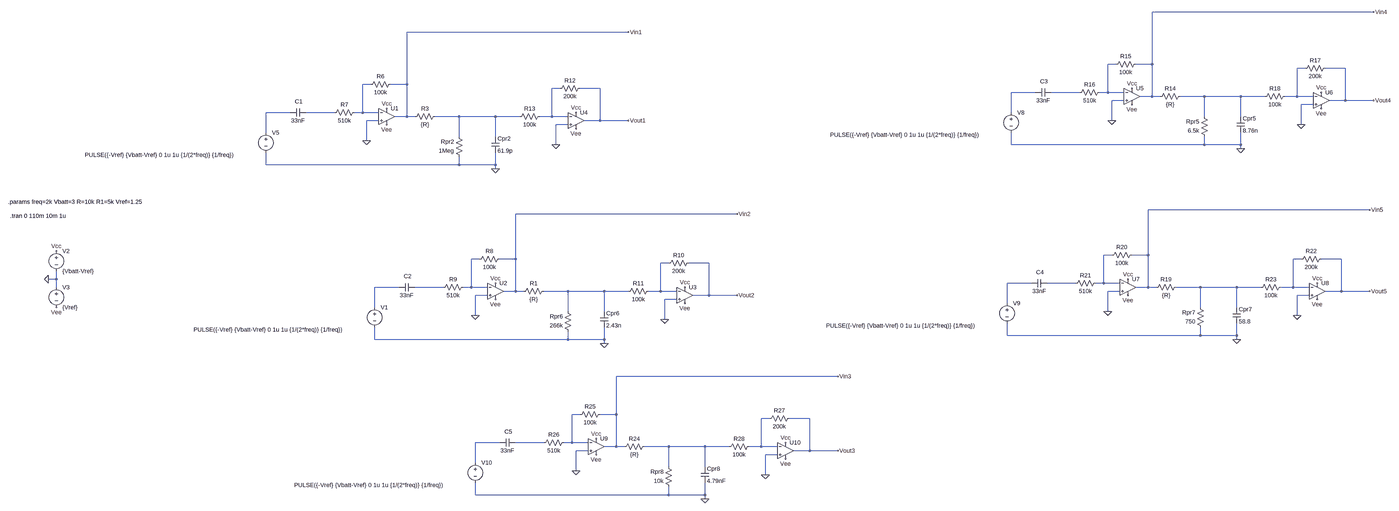
[diagram p0: schematic Data.asc, whole sheet]
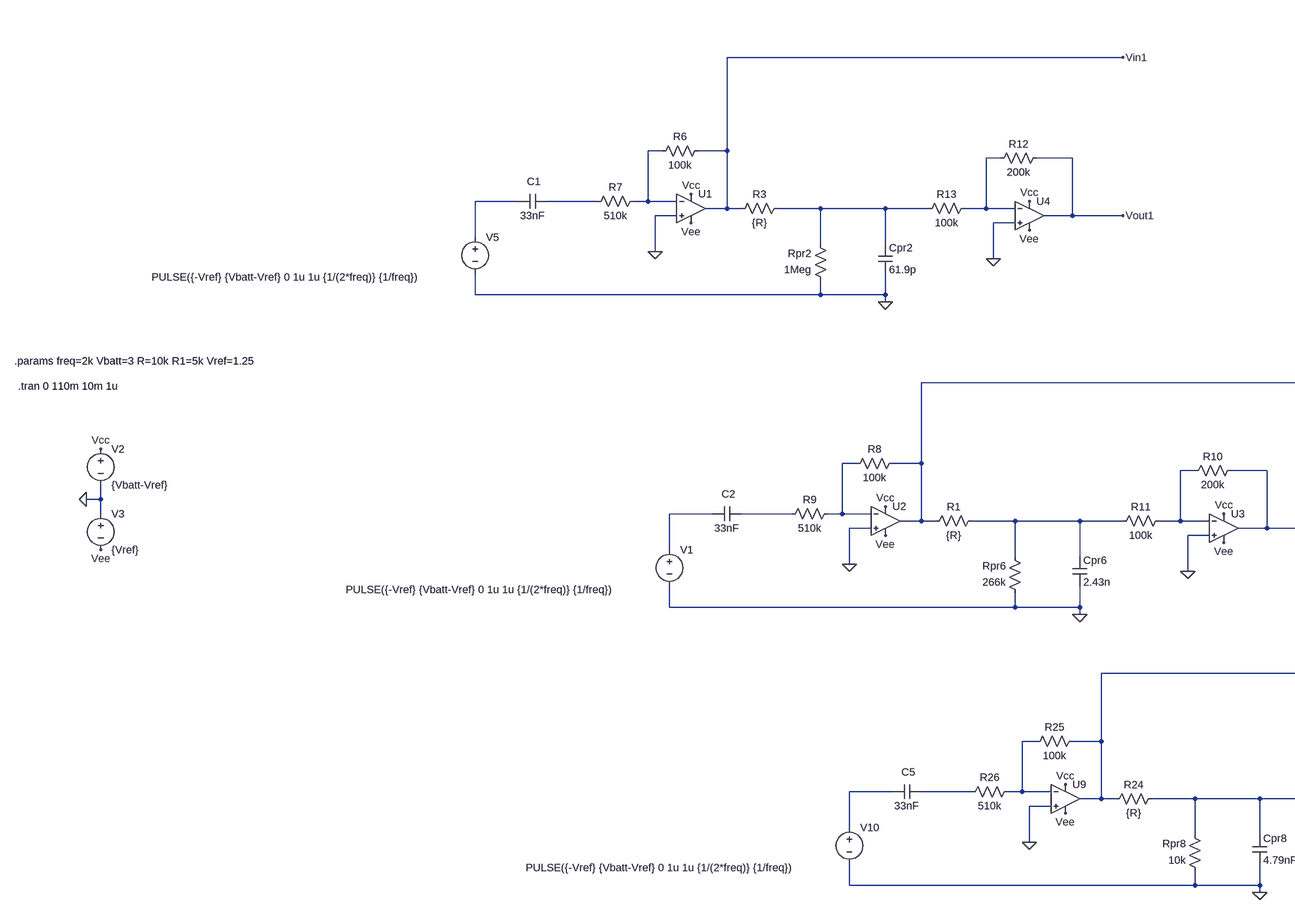
[diagram p1: schematic Data.asc, part, row 1 of 1, column 1 of 2]
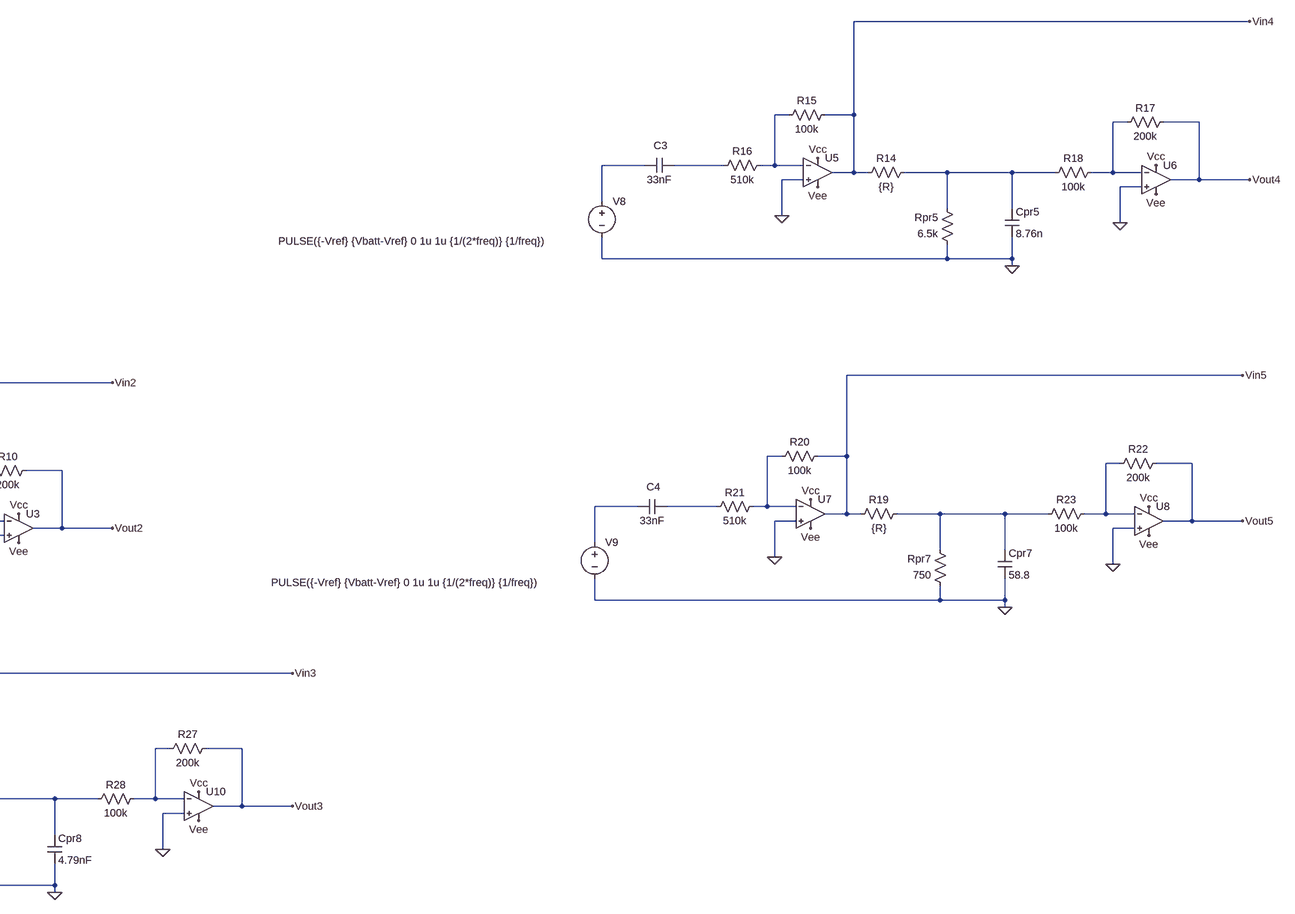
[diagram p2: schematic Data.asc, part, row 1 of 1, column 2 of 2]
Data.asc, the LTspice schematic file:
Version 4
SHEET 1 6228 2164
WIRE 6144 -448 5264 -448
WIRE 3184 -368 2304 -368
WIRE 5120 -240 5088 -240
WIRE 5264 -240 5264 -448
WIRE 5264 -240 5200 -240
WIRE 5872 -224 5840 -224
WIRE 6032 -224 5952 -224
WIRE 2160 -160 2128 -160
WIRE 2304 -160 2304 -368
WIRE 2304 -160 2240 -160
WIRE 2912 -144 2880 -144
WIRE 3072 -144 2992 -144
WIRE 4800 -128 4704 -128
WIRE 4976 -128 4864 -128
WIRE 5088 -128 5088 -240
WIRE 5088 -128 5056 -128
WIRE 5152 -128 5088 -128
WIRE 5264 -112 5264 -240
WIRE 5264 -112 5216 -112
WIRE 5296 -112 5264 -112
WIRE 5472 -112 5376 -112
WIRE 5616 -112 5472 -112
WIRE 5712 -112 5616 -112
WIRE 5840 -112 5840 -224
WIRE 5840 -112 5792 -112
WIRE 5904 -112 5840 -112
WIRE 5152 -96 5104 -96
WIRE 6032 -96 6032 -224
WIRE 6032 -96 5968 -96
WIRE 6144 -96 6032 -96
WIRE 5904 -80 5856 -80
WIRE 1840 -48 1744 -48
WIRE 2016 -48 1904 -48
WIRE 2128 -48 2128 -160
WIRE 2128 -48 2096 -48
WIRE 2192 -48 2128 -48
WIRE 4704 -48 4704 -128
WIRE 2304 -32 2304 -160
WIRE 2304 -32 2256 -32
WIRE 2336 -32 2304 -32
WIRE 2512 -32 2416 -32
WIRE 2656 -32 2512 -32
WIRE 2752 -32 2656 -32
WIRE 2880 -32 2880 -144
WIRE 2880 -32 2832 -32
WIRE 2944 -32 2880 -32
WIRE 5472 -32 5472 -112
WIRE 5616 -32 5616 -112
WIRE 2192 -16 2144 -16
WIRE 3072 -16 3072 -144
WIRE 3072 -16 3008 -16
WIRE 3184 -16 3072 -16
WIRE 5104 -16 5104 -96
WIRE 2944 0 2896 0
WIRE 5856 0 5856 -80
WIRE 1744 32 1744 -48
WIRE 2512 48 2512 -32
WIRE 2656 48 2656 -32
WIRE 2144 64 2144 -16
WIRE 2896 80 2896 0
WIRE 4704 80 4704 32
WIRE 5472 80 5472 48
WIRE 5472 80 4704 80
WIRE 5616 80 5616 32
WIRE 5616 80 5472 80
WIRE 5616 96 5616 80
WIRE 1744 160 1744 112
WIRE 2512 160 2512 128
WIRE 2512 160 1744 160
WIRE 2656 160 2656 112
WIRE 2656 160 2512 160
WIRE 2656 176 2656 160
WIRE 6128 656 5248 656
WIRE 3616 672 2736 672
WIRE 5104 864 5072 864
WIRE 5248 864 5248 656
WIRE 5248 864 5184 864
WIRE 2592 880 2560 880
WIRE 2736 880 2736 672
WIRE 2736 880 2672 880
WIRE 5856 880 5824 880
WIRE 6016 880 5936 880
WIRE 3344 896 3312 896
WIRE 3504 896 3424 896
WIRE 912 960 912 928
WIRE 912 960 880 960
WIRE 4784 976 4688 976
WIRE 4960 976 4848 976
WIRE 5072 976 5072 864
WIRE 5072 976 5040 976
WIRE 5136 976 5072 976
WIRE 912 992 912 960
WIRE 2272 992 2176 992
WIRE 2448 992 2336 992
WIRE 2560 992 2560 880
WIRE 2560 992 2528 992
WIRE 2624 992 2560 992
WIRE 5248 992 5248 864
WIRE 5248 992 5200 992
WIRE 5280 992 5248 992
WIRE 5456 992 5360 992
WIRE 5600 992 5456 992
WIRE 5696 992 5600 992
WIRE 5824 992 5824 880
WIRE 5824 992 5776 992
WIRE 5888 992 5824 992
WIRE 2736 1008 2736 880
WIRE 2736 1008 2688 1008
WIRE 2768 1008 2736 1008
WIRE 2944 1008 2848 1008
WIRE 3088 1008 2944 1008
WIRE 3184 1008 3088 1008
WIRE 3312 1008 3312 896
WIRE 3312 1008 3264 1008
WIRE 3376 1008 3312 1008
WIRE 5136 1008 5088 1008
WIRE 6016 1008 6016 880
WIRE 6016 1008 5952 1008
WIRE 6128 1008 6016 1008
WIRE 2624 1024 2576 1024
WIRE 3504 1024 3504 896
WIRE 3504 1024 3440 1024
WIRE 3616 1024 3504 1024
WIRE 5888 1024 5840 1024
WIRE 3376 1040 3328 1040
WIRE 4688 1056 4688 976
WIRE 2176 1072 2176 992
WIRE 5456 1072 5456 992
WIRE 5600 1072 5600 992
WIRE 2944 1088 2944 1008
WIRE 3088 1088 3088 1008
WIRE 5088 1088 5088 1008
WIRE 2576 1104 2576 1024
WIRE 5840 1104 5840 1024
WIRE 3328 1120 3328 1040
WIRE 4688 1184 4688 1136
WIRE 5456 1184 5456 1152
WIRE 5456 1184 4688 1184
WIRE 5600 1184 5600 1136
WIRE 5600 1184 5456 1184
WIRE 2176 1200 2176 1152
WIRE 2944 1200 2944 1168
WIRE 2944 1200 2176 1200
WIRE 3088 1200 3088 1152
WIRE 3088 1200 2944 1200
WIRE 5600 1200 5600 1184
WIRE 3088 1216 3088 1200
WIRE 4016 1600 3136 1600
WIRE 2992 1808 2960 1808
WIRE 3136 1808 3136 1600
WIRE 3136 1808 3072 1808
WIRE 3744 1824 3712 1824
WIRE 3904 1824 3824 1824
WIRE 2672 1920 2576 1920
WIRE 2848 1920 2736 1920
WIRE 2960 1920 2960 1808
WIRE 2960 1920 2928 1920
WIRE 3024 1920 2960 1920
WIRE 3136 1936 3136 1808
WIRE 3136 1936 3088 1936
WIRE 3168 1936 3136 1936
WIRE 3344 1936 3248 1936
WIRE 3488 1936 3344 1936
WIRE 3584 1936 3488 1936
WIRE 3712 1936 3712 1824
WIRE 3712 1936 3664 1936
WIRE 3776 1936 3712 1936
WIRE 3024 1952 2976 1952
WIRE 3904 1952 3904 1824
WIRE 3904 1952 3840 1952
WIRE 4016 1952 3904 1952
WIRE 3776 1968 3728 1968
WIRE 2576 2000 2576 1920
WIRE 3344 2016 3344 1936
WIRE 3488 2016 3488 1936
WIRE 2976 2032 2976 1952
WIRE 3728 2048 3728 1968
WIRE 2576 2128 2576 2080
WIRE 3344 2128 3344 2096
WIRE 3344 2128 2576 2128
WIRE 3488 2128 3488 2080
WIRE 3488 2128 3344 2128
WIRE 3488 2144 3488 2128
FLAG 880 960 0
FLAG 912 848 Vcc
FLAG 912 1072 Vee
FLAG 2656 176 0
FLAG 2224 0 Vee
FLAG 2224 -64 Vcc
FLAG 2144 64 0
FLAG 2976 16 Vee
FLAG 2976 -48 Vcc
FLAG 2896 80 0
FLAG 5616 96 0
FLAG 5184 -80 Vee
FLAG 5184 -144 Vcc
FLAG 5104 -16 0
FLAG 5936 -64 Vee
FLAG 5936 -128 Vcc
FLAG 5856 0 0
FLAG 3088 1216 0
FLAG 2656 1040 Vee
FLAG 2656 976 Vcc
FLAG 2576 1104 0
FLAG 3408 1056 Vee
FLAG 3408 992 Vcc
FLAG 3328 1120 0
FLAG 3616 672 Vin2
FLAG 3616 1024 Vout2
FLAG 5600 1200 0
FLAG 5168 1024 Vee
FLAG 5168 960 Vcc
FLAG 5088 1088 0
FLAG 5920 1040 Vee
FLAG 5920 976 Vcc
FLAG 5840 1104 0
FLAG 3488 2144 0
FLAG 3056 1968 Vee
FLAG 3056 1904 Vcc
FLAG 2976 2032 0
FLAG 3808 1984 Vee
FLAG 3808 1920 Vcc
FLAG 3728 2048 0
FLAG 3184 -368 Vin1
FLAG 4016 1600 Vin3
FLAG 6144 -448 Vin4
FLAG 6128 656 Vin5
FLAG 3184 -16 Vout1
FLAG 6144 -96 Vout4
FLAG 6128 1008 Vout5
FLAG 4016 1952 Vout3
SYMBOL voltage 912 832 R0
WINDOW 123 0 0 Left 0
WINDOW 39 0 0 Left 0
SYMATTR InstName V2
SYMATTR Value {Vbatt-Vref}
SYMBOL voltage 912 976 R0
WINDOW 123 0 0 Left 0
WINDOW 39 0 0 Left 0
SYMATTR InstName V3
SYMATTR Value {Vref}
SYMBOL res 2432 -48 R90
WINDOW 0 0 56 VBottom 2
WINDOW 3 32 56 VTop 2
SYMATTR InstName R3
SYMATTR Value {R}
SYMBOL res 2528 144 R180
WINDOW 0 36 76 Left 2
WINDOW 3 36 40 Left 2
SYMATTR InstName Rpr2
SYMATTR Value 1Meg
SYMBOL cap 2640 48 R0
SYMATTR InstName Cpr2
SYMATTR Value 61.9p
SYMBOL voltage 1744 16 R0
WINDOW 123 0 0 Left 0
WINDOW 39 0 0 Left 0
WINDOW 3 -719 105 Left 2
SYMATTR Value PULSE({-Vref} {Vbatt-Vref} 0 1u 1u {1/(2*freq)} {1/freq})
SYMATTR InstName V5
SYMBOL Opamps\\UniversalOpamp2 2224 -32 R0
SYMATTR InstName U1
SYMATTR Value2 Avol=1Meg GBW=14k Slew=3.5Meg
SYMATTR SpiceLine ilimit=25m rail=0 Vos=2m phimargin=45
SYMBOL res 2256 -176 R90
WINDOW 0 0 56 VBottom 2
WINDOW 3 32 56 VTop 2
SYMATTR InstName R6
SYMATTR Value 100k
SYMBOL res 2112 -64 R90
WINDOW 0 0 56 VBottom 2
WINDOW 3 32 56 VTop 2
SYMATTR InstName R7
SYMATTR Value 510k
SYMBOL Opamps\\UniversalOpamp2 2976 -16 R0
SYMATTR InstName U4
SYMATTR Value2 Avol=1Meg GBW=14k Slew=3.5Meg
SYMBOL res 3008 -160 R90
WINDOW 0 0 56 VBottom 2
WINDOW 3 32 56 VTop 2
SYMATTR InstName R12
SYMATTR Value 200k
SYMBOL res 2848 -48 R90
WINDOW 0 0 56 VBottom 2
WINDOW 3 32 56 VTop 2
SYMATTR InstName R13
SYMATTR Value 100k
SYMBOL cap 1904 -64 R90
WINDOW 0 -12 29 VBottom 2
WINDOW 3 32 32 VTop 2
SYMATTR InstName C1
SYMATTR Value 33nF
SYMBOL res 5392 -128 R90
WINDOW 0 0 56 VBottom 2
WINDOW 3 32 56 VTop 2
SYMATTR InstName R14
SYMATTR Value {R}
SYMBOL res 5488 64 R180
WINDOW 0 36 76 Left 2
WINDOW 3 36 40 Left 2
SYMATTR InstName Rpr5
SYMATTR Value 6.5k
SYMBOL cap 5600 -32 R0
SYMATTR InstName Cpr5
SYMATTR Value 8.76n
SYMBOL voltage 4704 -64 R0
WINDOW 123 0 0 Left 0
WINDOW 39 0 0 Left 0
WINDOW 3 -719 105 Left 2
SYMATTR Value PULSE({-Vref} {Vbatt-Vref} 0 1u 1u {1/(2*freq)} {1/freq})
SYMATTR InstName V8
SYMBOL Opamps\\UniversalOpamp2 5184 -112 R0
SYMATTR InstName U5
SYMATTR Value2 Avol=1Meg GBW=14k Slew=3.5Meg
SYMATTR SpiceLine ilimit=25m rail=0 Vos=2m phimargin=45
SYMBOL res 5216 -256 R90
WINDOW 0 0 56 VBottom 2
WINDOW 3 32 56 VTop 2
SYMATTR InstName R15
SYMATTR Value 100k
SYMBOL res 5072 -144 R90
WINDOW 0 0 56 VBottom 2
WINDOW 3 32 56 VTop 2
SYMATTR InstName R16
SYMATTR Value 510k
SYMBOL Opamps\\UniversalOpamp2 5936 -96 R0
SYMATTR InstName U6
SYMATTR Value2 Avol=1Meg GBW=14k Slew=3.5Meg
SYMBOL res 5968 -240 R90
WINDOW 0 0 56 VBottom 2
WINDOW 3 32 56 VTop 2
SYMATTR InstName R17
SYMATTR Value 200k
SYMBOL res 5808 -128 R90
WINDOW 0 0 56 VBottom 2
WINDOW 3 32 56 VTop 2
SYMATTR InstName R18
SYMATTR Value 100k
SYMBOL cap 4864 -144 R90
WINDOW 0 -12 29 VBottom 2
WINDOW 3 32 32 VTop 2
SYMATTR InstName C3
SYMATTR Value 33nF
SYMBOL res 2864 992 R90
WINDOW 0 0 56 VBottom 2
WINDOW 3 32 56 VTop 2
SYMATTR InstName R1
SYMATTR Value {R}
SYMBOL res 2960 1184 R180
WINDOW 0 36 76 Left 2
WINDOW 3 36 40 Left 2
SYMATTR InstName Rpr6
SYMATTR Value 266k
SYMBOL cap 3072 1088 R0
SYMATTR InstName Cpr6
SYMATTR Value 2.43n
SYMBOL voltage 2176 1056 R0
WINDOW 123 0 0 Left 0
WINDOW 39 0 0 Left 0
WINDOW 3 -719 105 Left 2
SYMATTR Value PULSE({-Vref} {Vbatt-Vref} 0 1u 1u {1/(2*freq)} {1/freq})
SYMATTR InstName V1
SYMBOL Opamps\\UniversalOpamp2 2656 1008 R0
SYMATTR InstName U2
SYMATTR Value2 Avol=1Meg GBW=14k Slew=3.5Meg
SYMATTR SpiceLine ilimit=25m rail=0 Vos=2m phimargin=45
SYMBOL res 2688 864 R90
WINDOW 0 0 56 VBottom 2
WINDOW 3 32 56 VTop 2
SYMATTR InstName R8
SYMATTR Value 100k
SYMBOL res 2544 976 R90
WINDOW 0 0 56 VBottom 2
WINDOW 3 32 56 VTop 2
SYMATTR InstName R9
SYMATTR Value 510k
SYMBOL Opamps\\UniversalOpamp2 3408 1024 R0
SYMATTR InstName U3
SYMATTR Value2 Avol=1Meg GBW=14k Slew=3.5Meg
SYMBOL res 3440 880 R90
WINDOW 0 0 56 VBottom 2
WINDOW 3 32 56 VTop 2
SYMATTR InstName R10
SYMATTR Value 200k
SYMBOL res 3280 992 R90
WINDOW 0 0 56 VBottom 2
WINDOW 3 32 56 VTop 2
SYMATTR InstName R11
SYMATTR Value 100k
SYMBOL cap 2336 976 R90
WINDOW 0 -12 29 VBottom 2
WINDOW 3 32 32 VTop 2
SYMATTR InstName C2
SYMATTR Value 33nF
SYMBOL res 5376 976 R90
WINDOW 0 0 56 VBottom 2
WINDOW 3 32 56 VTop 2
SYMATTR InstName R19
SYMATTR Value {R}
SYMBOL res 5472 1168 R180
WINDOW 0 36 76 Left 2
WINDOW 3 36 40 Left 2
SYMATTR InstName Rpr7
SYMATTR Value 750
SYMBOL cap 5584 1072 R0
SYMATTR InstName Cpr7
SYMATTR Value 58.8
SYMBOL voltage 4688 1040 R0
WINDOW 123 0 0 Left 0
WINDOW 39 0 0 Left 0
WINDOW 3 -719 105 Left 2
SYMATTR Value PULSE({-Vref} {Vbatt-Vref} 0 1u 1u {1/(2*freq)} {1/freq})
SYMATTR InstName V9
SYMBOL Opamps\\UniversalOpamp2 5168 992 R0
SYMATTR InstName U7
SYMATTR Value2 Avol=1Meg GBW=14k Slew=3.5Meg
SYMATTR SpiceLine ilimit=25m rail=0 Vos=2m phimargin=45
SYMBOL res 5200 848 R90
WINDOW 0 0 56 VBottom 2
WINDOW 3 32 56 VTop 2
SYMATTR InstName R20
SYMATTR Value 100k
SYMBOL res 5056 960 R90
WINDOW 0 0 56 VBottom 2
WINDOW 3 32 56 VTop 2
SYMATTR InstName R21
SYMATTR Value 510k
SYMBOL Opamps\\UniversalOpamp2 5920 1008 R0
SYMATTR InstName U8
SYMATTR Value2 Avol=1Meg GBW=14k Slew=3.5Meg
SYMBOL res 5952 864 R90
WINDOW 0 0 56 VBottom 2
WINDOW 3 32 56 VTop 2
SYMATTR InstName R22
SYMATTR Value 200k
SYMBOL res 5792 976 R90
WINDOW 0 0 56 VBottom 2
WINDOW 3 32 56 VTop 2
SYMATTR InstName R23
SYMATTR Value 100k
SYMBOL cap 4848 960 R90
WINDOW 0 -12 29 VBottom 2
WINDOW 3 32 32 VTop 2
SYMATTR InstName C4
SYMATTR Value 33nF
SYMBOL res 3264 1920 R90
WINDOW 0 0 56 VBottom 2
WINDOW 3 32 56 VTop 2
SYMATTR InstName R24
SYMATTR Value {R}
SYMBOL res 3360 2112 R180
WINDOW 0 36 76 Left 2
WINDOW 3 36 40 Left 2
SYMATTR InstName Rpr8
SYMATTR Value 10k
SYMBOL cap 3472 2016 R0
SYMATTR InstName Cpr8
SYMATTR Value 4.79nF
SYMBOL voltage 2576 1984 R0
WINDOW 123 0 0 Left 0
WINDOW 39 0 0 Left 0
WINDOW 3 -719 105 Left 2
SYMATTR Value PULSE({-Vref} {Vbatt-Vref} 0 1u 1u {1/(2*freq)} {1/freq})
SYMATTR InstName V10
SYMBOL Opamps\\UniversalOpamp2 3056 1936 R0
SYMATTR InstName U9
SYMATTR Value2 Avol=1Meg GBW=14k Slew=3.5Meg
SYMATTR SpiceLine ilimit=25m rail=0 Vos=2m phimargin=45
SYMBOL res 3088 1792 R90
WINDOW 0 0 56 VBottom 2
WINDOW 3 32 56 VTop 2
SYMATTR InstName R25
SYMATTR Value 100k
SYMBOL res 2944 1904 R90
WINDOW 0 0 56 VBottom 2
WINDOW 3 32 56 VTop 2
SYMATTR InstName R26
SYMATTR Value 510k
SYMBOL Opamps\\UniversalOpamp2 3808 1952 R0
SYMATTR InstName U10
SYMATTR Value2 Avol=1Meg GBW=14k Slew=3.5Meg
SYMBOL res 3840 1808 R90
WINDOW 0 0 56 VBottom 2
WINDOW 3 32 56 VTop 2
SYMATTR InstName R27
SYMATTR Value 200k
SYMBOL res 3680 1920 R90
WINDOW 0 0 56 VBottom 2
WINDOW 3 32 56 VTop 2
SYMATTR InstName R28
SYMATTR Value 100k
SYMBOL cap 2736 1904 R90
WINDOW 0 -12 29 VBottom 2
WINDOW 3 32 32 VTop 2
SYMATTR InstName C5
SYMATTR Value 33nF
TEXT 720 624 Left 2 !.params freq=2k Vbatt=3 R=10k R1=5k Vref=1.25
TEXT 728 680 Left 2 !.tran 0 110m 10m 1u

The netlist it stands for:
* Data.asc
V2 Vcc 0 {Vbatt-Vref}
V3 0 Vee {Vref}
R3 N010 Vin1 {R}
Rpr2 0 N010 1Meg
Cpr2 N010 0 61.9p
V5 N008 0 PULSE({-Vref} {Vbatt-Vref} 0 1u 1u {1/(2*freq)} {1/freq})
XU1 0 N003 Vcc Vee Vin1 level.2 Avol=1Meg GBW=14k Slew=3.5Meg ilimit=25m rail=0 Vos=2m phimargin=45 en=0 enk=0 in=0 ink=0 Rin=500Meg  ; pins IN+ IN- V+ V- OUT
R6 Vin1 N003 100k
R7 N003 N009 510k
XU4 0 N004 Vcc Vee Vout1 level.2 Avol=1Meg GBW=14k Slew=3.5Meg ilimit=25m rail=0 Vos=0 phimargin=45 en=0 enk=0 in=0 ink=0 Rin=500Meg  ; pins IN+ IN- V+ V- OUT
R12 Vout1 N004 200k
R13 N004 N010 100k
C1 N009 N008 33nF
R14 N007 Vin4 {R}
Rpr5 0 N007 6.5k
Cpr5 N007 0 8.76n
V8 N005 0 PULSE({-Vref} {Vbatt-Vref} 0 1u 1u {1/(2*freq)} {1/freq})
XU5 0 N001 Vcc Vee Vin4 level.2 Avol=1Meg GBW=14k Slew=3.5Meg ilimit=25m rail=0 Vos=2m phimargin=45 en=0 enk=0 in=0 ink=0 Rin=500Meg  ; pins IN+ IN- V+ V- OUT
R15 Vin4 N001 100k
R16 N001 N006 510k
XU6 0 N002 Vcc Vee Vout4 level.2 Avol=1Meg GBW=14k Slew=3.5Meg ilimit=25m rail=0 Vos=0 phimargin=45 en=0 enk=0 in=0 ink=0 Rin=500Meg  ; pins IN+ IN- V+ V- OUT
R17 Vout4 N002 200k
R18 N002 N007 100k
C3 N006 N005 33nF
R1 N020 Vin2 {R}
Rpr6 0 N020 266k
Cpr6 N020 0 2.43n
V1 N017 0 PULSE({-Vref} {Vbatt-Vref} 0 1u 1u {1/(2*freq)} {1/freq})
XU2 0 N012 Vcc Vee Vin2 level.2 Avol=1Meg GBW=14k Slew=3.5Meg ilimit=25m rail=0 Vos=2m phimargin=45 en=0 enk=0 in=0 ink=0 Rin=500Meg  ; pins IN+ IN- V+ V- OUT
R8 Vin2 N012 100k
R9 N012 N018 510k
XU3 0 N014 Vcc Vee Vout2 level.2 Avol=1Meg GBW=14k Slew=3.5Meg ilimit=25m rail=0 Vos=0 phimargin=45 en=0 enk=0 in=0 ink=0 Rin=500Meg  ; pins IN+ IN- V+ V- OUT
R10 Vout2 N014 200k
R11 N014 N020 100k
C2 N018 N017 33nF
R19 N019 Vin5 {R}
Rpr7 0 N019 750
Cpr7 N019 0 58.8
V9 N015 0 PULSE({-Vref} {Vbatt-Vref} 0 1u 1u {1/(2*freq)} {1/freq})
XU7 0 N011 Vcc Vee Vin5 level.2 Avol=1Meg GBW=14k Slew=3.5Meg ilimit=25m rail=0 Vos=2m phimargin=45 en=0 enk=0 in=0 ink=0 Rin=500Meg  ; pins IN+ IN- V+ V- OUT
R20 Vin5 N011 100k
R21 N011 N016 510k
XU8 0 N013 Vcc Vee Vout5 level.2 Avol=1Meg GBW=14k Slew=3.5Meg ilimit=25m rail=0 Vos=0 phimargin=45 en=0 enk=0 in=0 ink=0 Rin=500Meg  ; pins IN+ IN- V+ V- OUT
R22 Vout5 N013 200k
R23 N013 N019 100k
C4 N016 N015 33nF
R24 N025 Vin3 {R}
Rpr8 0 N025 10k
Cpr8 N025 0 4.79nF
V10 N023 0 PULSE({-Vref} {Vbatt-Vref} 0 1u 1u {1/(2*freq)} {1/freq})
XU9 0 N021 Vcc Vee Vin3 level.2 Avol=1Meg GBW=14k Slew=3.5Meg ilimit=25m rail=0 Vos=2m phimargin=45 en=0 enk=0 in=0 ink=0 Rin=500Meg  ; pins IN+ IN- V+ V- OUT
R25 Vin3 N021 100k
R26 N021 N024 510k
XU10 0 N022 Vcc Vee Vout3 level.2 Avol=1Meg GBW=14k Slew=3.5Meg ilimit=25m rail=0 Vos=0 phimargin=45 en=0 enk=0 in=0 ink=0 Rin=500Meg  ; pins IN+ IN- V+ V- OUT
R27 Vout3 N022 200k
R28 N022 N025 100k
C5 N024 N023 33nF
.params freq=2k Vbatt=3 R=10k R1=5k Vref=1.25
.tran 0 110m 10m 1u
.lib UniversalOpamps2.sub
.backanno
.end